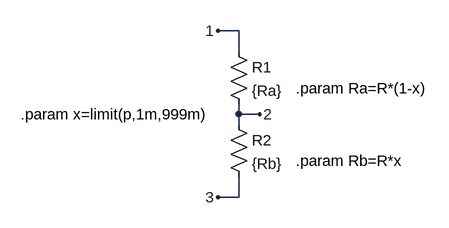
[diagram p0: schematic pot.asc]
pot.asc, the LTspice schematic file:
Version 4
SHEET 1 880 680
WIRE 160 16 128 16
WIRE 160 48 160 16
WIRE 160 144 160 128
WIRE 192 144 160 144
WIRE 160 160 160 144
WIRE 160 272 160 240
WIRE 160 272 128 272
FLAG 128 16 1
FLAG 192 144 2
FLAG 128 272 3
SYMBOL res 144 144 R0
SYMATTR InstName R2
SYMATTR Value {Rb}
SYMBOL res 144 32 R0
SYMATTR InstName R1
SYMATTR Value {Ra}
TEXT 248 104 Left 2 !.param Ra=R*(1-x)
TEXT 248 216 Left 2 !.param Rb=R*x
TEXT -176 144 Left 2 !.param x=limit(p,1m,999m)

The netlist it stands for:
* pot.asc
R2 2 3 {Rb}
R1 1 2 {Ra}
.param Ra=R*(1-x)
.param Rb=R*x
.param x=limit(p,1m,999m)
.backanno
.end